# EAGLE design Charger Board_3 (Sam_Test) (EAGLE 6.5.0)
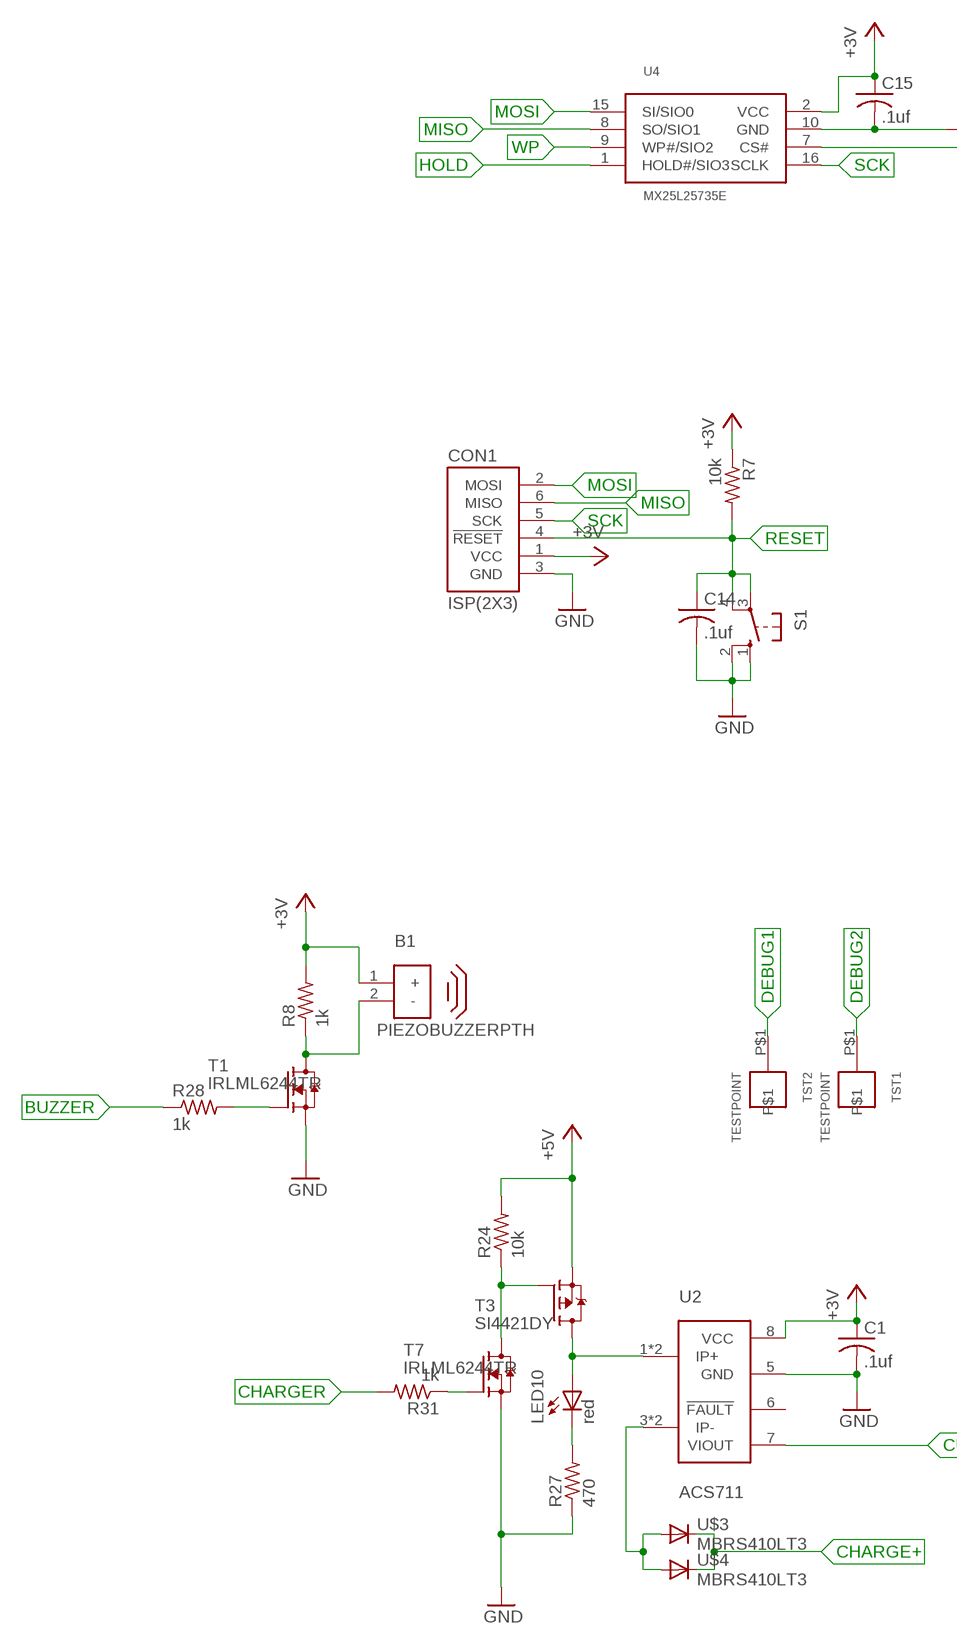
[diagram p0: schematic, sheet 1, part 1 of 2]
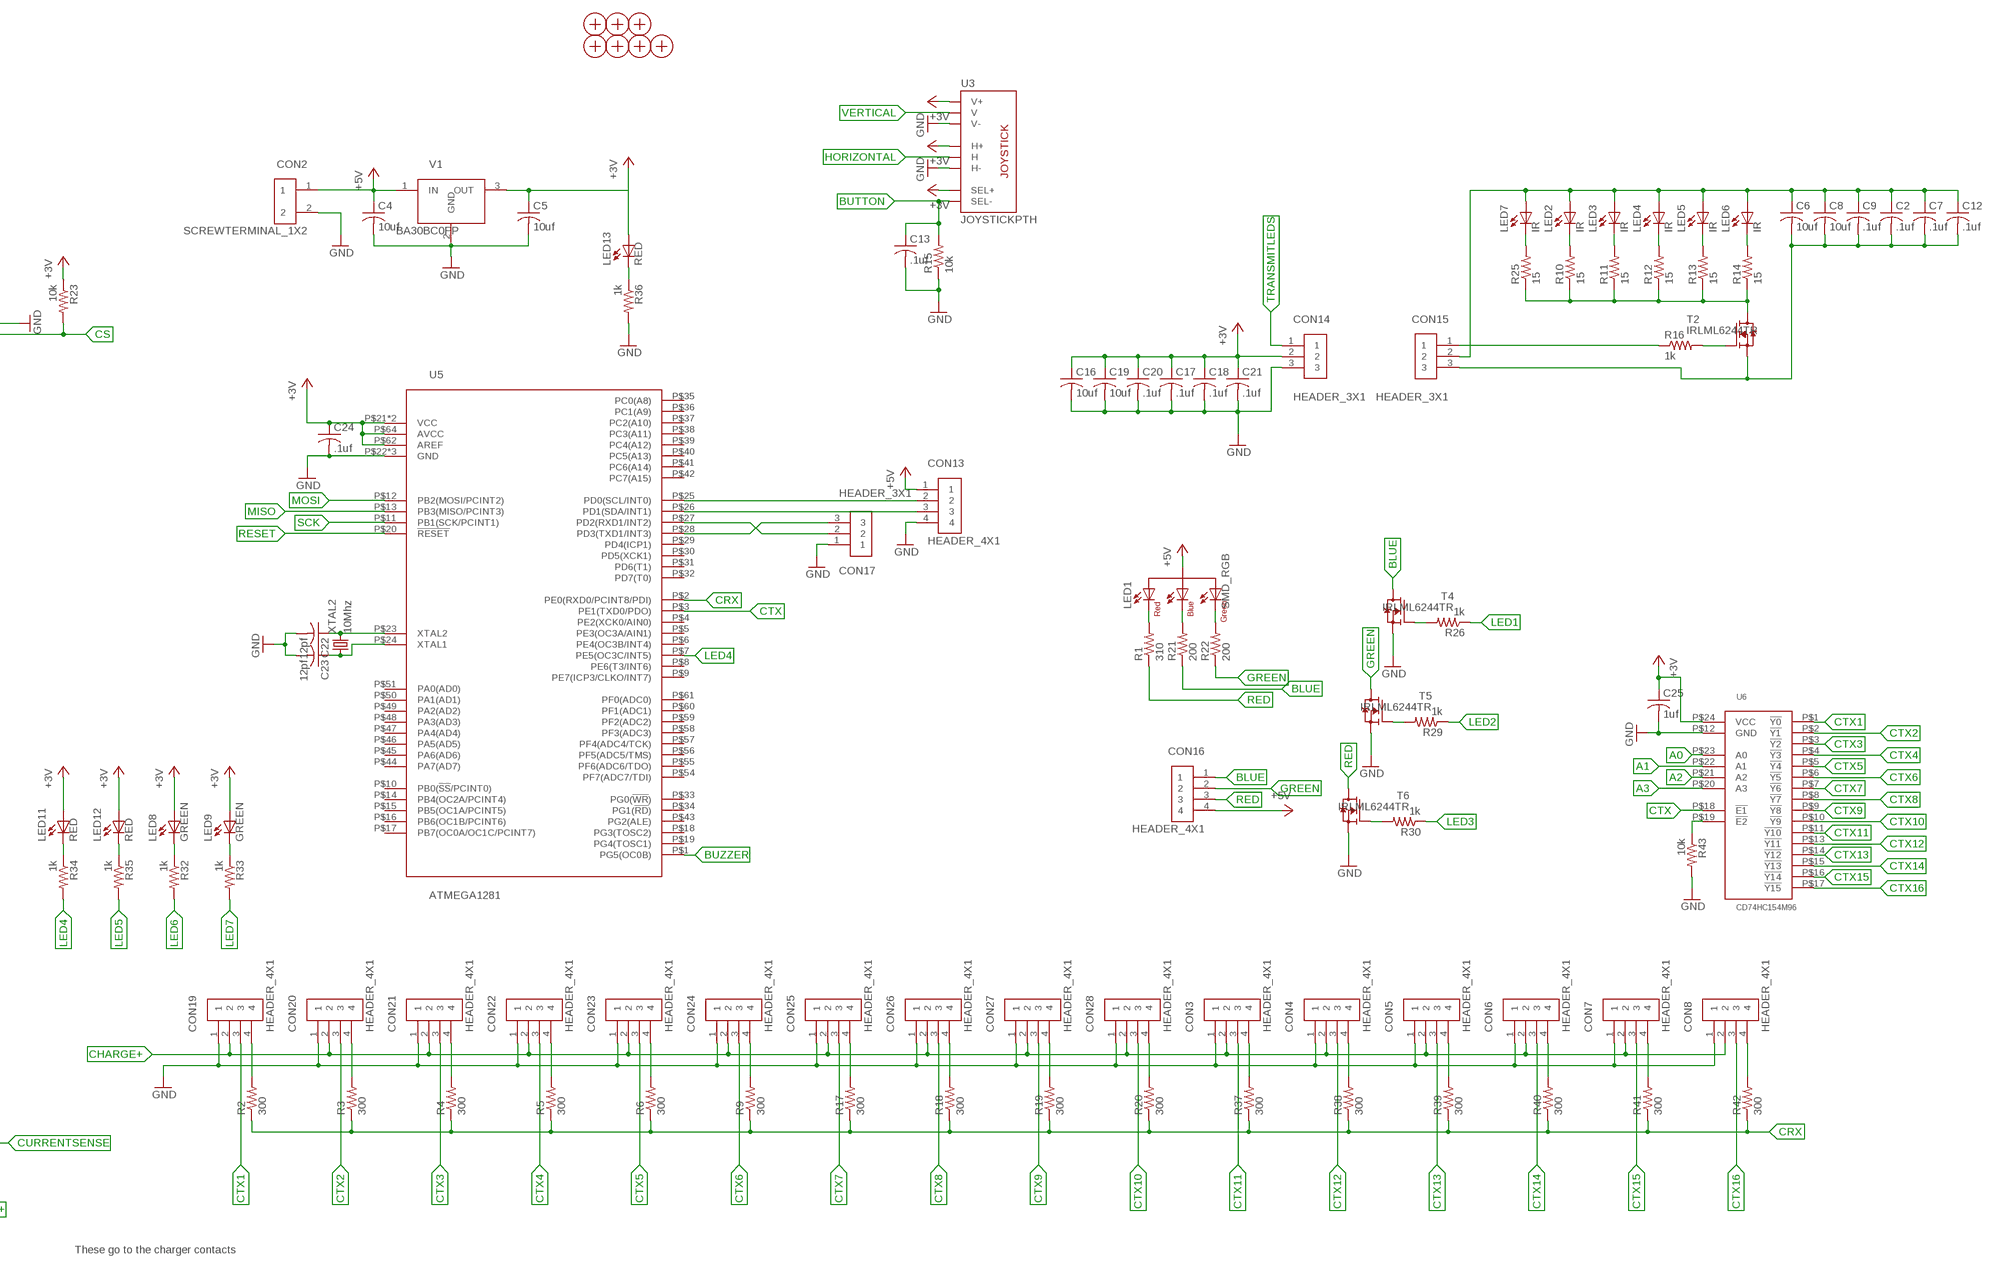
[diagram p1: schematic, sheet 1, part 2 of 2]

## Parts
B1  PIEZOBUZZERPTH  [PIEZOBUZZER]
C1  .1uf  CAP0603  [0603]
C2  .1uf  CAP0603  [0603]
C4  10uf  CAP0805  [0805]
C5  10uf  CAP0805  [0805]
C6  10uf  CAP0805  [0805]
C7  .1uf  CAP0603  [0603]
C8  10uf  CAP0805  [0805]
C9  .1uf  CAP0603  [0603]
C12  .1uf  CAP0603  [0603]
C13  .1uf  CAP0603  [0603]
C14  .1uf  CAP0603  [0603]
C15  .1uf  CAP0603  [0603]
C16  10uf  CAP0805  [0805]
C17  .1uf  CAP0603  [0603]
C18  .1uf  CAP0603  [0603]
C19  10uf  CAP0805  [0805]
C20  .1uf  CAP0603  [0603]
C21  .1uf  CAP0603  [0603]
C22  12pf  CAP0603  [0603]
C23  12pf  CAP0603  [0603]
C24  .1uf  CAP0603  [0603]
C25  1uf  CAP0603  [0603]
CON1  ISP(2X3)  [PINHEADER(2X3)]
CON2  SCREWTERMINAL_1X2  [SCREWTERMINAL_1X2]
CON3  HEADER_4X1  [4PINHEADER_.100"]
CON4  HEADER_4X1  [4PINHEADER_.100"]
CON5  HEADER_4X1  [4PINHEADER_.100"]
CON6  HEADER_4X1  [4PINHEADER_.100"]
CON7  HEADER_4X1  [4PINHEADER_.100"]
CON8  HEADER_4X1  [4PINHEADER_.100"]
CON13  HEADER_4X1  [4PINHEADER_.100"]
CON14  HEADER_3X1  [3PINHEADER_.100"]
CON15  HEADER_3X1  [3PINHEADER_.100"]
CON16  HEADER_4X1  [4PINHEADER_.100"]
CON17  HEADER_3X1  [3PINHEADER_.100"]
CON19  HEADER_4X1  [4PINHEADER_.100"]
CON20  HEADER_4X1  [4PINHEADER_.100"]
CON21  HEADER_4X1  [4PINHEADER_.100"]
CON22  HEADER_4X1  [4PINHEADER_.100"]
CON23  HEADER_4X1  [4PINHEADER_.100"]
CON24  HEADER_4X1  [4PINHEADER_.100"]
CON25  HEADER_4X1  [4PINHEADER_.100"]
CON26  HEADER_4X1  [4PINHEADER_.100"]
CON27  HEADER_4X1  [4PINHEADER_.100"]
CON28  HEADER_4X1  [4PINHEADER_.100"]
H1  MOUNTINGHOLE  [MOUNTINGHOLE]
H2  MOUNTINGHOLE  [MOUNTINGHOLE]
H3  MOUNTINGHOLE  [MOUNTINGHOLE]
H4  MOUNTINGHOLE  [MOUNTINGHOLE]
H5  MOUNTINGHOLE  [MOUNTINGHOLE]
H6  MOUNTINGHOLE  [MOUNTINGHOLE]
H7  MOUNTINGHOLE  [MOUNTINGHOLE]
LED1  SMD_RGB  [PLCC4]
LED2  IR  LED5MMRA  [5MM_LED_RA]
LED3  IR  LED5MMRA  [5MM_LED_RA]
LED4  IR  LED5MMRA  [5MM_LED_RA]
LED5  IR  LED5MMRA  [5MM_LED_RA]
LED6  IR  LED5MMRA  [5MM_LED_RA]
LED7  IR  LED5MMRA  [5MM_LED_RA]
LED8  GREEN  LED0603  [LED0603]
LED9  GREEN  LED0603  [LED0603]
LED10  red  LED0603  [LED0603]
LED11  RED  LED0603  [LED0603]
LED12  RED  LED0603  [LED0603]
LED13  RED  LED0603  [LED0603]
R1  310  RES0603  [0603]
R2  300  RES0603  [0603]
R3  300  RES0603  [0603]
R4  300  RES0603  [0603]
R5  300  RES0603  [0603]
R6  300  RES0603  [0603]
R7  10k  RES0603  [0603]
R8  1k  RES0603  [0603]
R9  300  RES0603  [0603]
R10  15  RES0603  [0603]
R11  15  RES0603  [0603]
R12  15  RES0603  [0603]
R13  15  RES0603  [0603]
R14  15  RES0603  [0603]
R15  10k  RES0603  [0603]
R16  1k  RES0603  [0603]
R17  300  RES0603  [0603]
R18  300  RES0603  [0603]
R19  300  RES0603  [0603]
R20  300  RES0603  [0603]
R21  200  RES0603  [0603]
R22  200  RES0603  [0603]
R23  10k  RES0603  [0603]
R24  10k  RES0603  [0603]
R25  15  RES0603  [0603]
R26  1k  RES0603  [0603]
R27  470  RES0603  [0603]
R28  1k  RES0603  [0603]
R29  1k  RES0603  [0603]
R30  1k  RES0603  [0603]
R31  1k  RES0603  [0603]
R32  1k  RES0603  [0603]
R33  1k  RES0603  [0603]
R34  1k  RES0603  [0603]
R35  1k  RES0603  [0603]
R36  1k  RES0603  [0603]
R37  300  RES0603  [0603]
R38  300  RES0603  [0603]
R39  300  RES0603  [0603]
R40  300  RES0603  [0603]
R41  300  RES0603  [0603]
R42  300  RES0603  [0603]
R43  10k  RES0603  [0603]
S1  10-XX  [B3F-10XX]
T1  IRLML6244TR  [SOT23]
T2  IRLML6244TR  [SOT23]
T3  SI4421DY  [S0-8]
T4  IRLML6244TR  [SOT23]
T5  IRLML6244TR  [SOT23]
T6  IRLML6244TR  [SOT23]
T7  IRLML6244TR  [SOT23]
TST1  TESTPOINT  [TESTPOINT]
TST2  TESTPOINT  [TESTPOINT]
U2  ACS711  [8SOIC]
U3  JOYSTICKPTH  [JOYSTICK]
U4  MX25L25735E  [SOIC16R]
U5  ATMEGA1281  [TQFP64]
U6  CD74HC154M96  [24SOIC]
U$3  MBRS410LT3  [SMD_DIODE]
U$4  MBRS410LT3  [SMD_DIODE]
V1  BA30BC0FP  [DPAK]
XTAL2  10Mhz  NX5032GA-10.000000MHZ  [SMDXTAL]

## Nets
+3V: B1.1(+) C1.1 C5.1 C15.1 C16.1 C17.1 C18.1 C19.1 C20.1 C21.1 C24.1 C25.1 CON1.1(VCC) CON14.2 LED8.2(A) LED9.2(A) LED11.2(A) LED12.2(A) LED13.2(A) R7.1 R8.2 R23.1 U2.8(VCC) U3.B1A(SEL+) U3.H1(H+) U3.V1(V+) U4.2(VCC) U5.P$21(VCC) U5.P$52(VCC) U5.P$62(AREF) U5.P$64(AVCC) U6.P$24(VCC) V1.3(OUT)
+5V: C4.1 CON2.1 CON13.1 CON16.4 LED1.2(COMMONANODE) R24.2 T3.1(S) T3.2(S) T3.3(S) V1.1(IN)
A0: U6.P$23(A0)
A1: U6.P$22(A1)
A2: U6.P$21(A2)
A3: U6.P$20(A3)
BLUE: CON16.1 R21.1 T4.3(D)
BUTTON: C13.1 R15.2 U3.B2A(SEL-)
BUZZER: R28.1 U5.P$1(PG5(OC0B))
CHARGE+: CON3.2 CON4.2 CON5.2 CON6.2 CON7.2 CON8.2 CON19.2 CON20.2 CON21.2 CON22.2 CON23.2 CON24.2 CON25.2 CON26.2 CON27.2 CON28.2 U$3.2(C) U$4.2(C)
CHARGER: R31.2
CRX: R2.1 R3.1 R4.1 R5.1 R6.1 R9.1 R17.1 R18.1 R19.1 R20.1 R37.1 R38.1 R39.1 R40.1 R41.1 R42.1 U5.P$2(PE0(RXD0/PCINT8/PDI))
CS: R23.2 U4.7(CS#)
CTX: U5.P$3(PE1(TXD0/PDO)) U6.P$18(!E1)
CTX1: CON19.3 U6.P$1(!Y0)
CTX2: CON20.3 U6.P$2(!Y1)
CTX3: CON21.3 U6.P$3(!Y2)
CTX4: CON22.3 U6.P$4(!Y3)
CTX5: CON23.3 U6.P$5(!Y4)
CTX6: CON24.3 U6.P$6(!Y5)
CTX7: CON25.3 U6.P$7(!Y6)
CTX8: CON26.3 U6.P$8(!Y7)
CTX9: CON27.3 U6.P$9(!Y8)
CTX10: CON28.3 U6.P$10(!Y9)
CTX11: CON3.3 U6.P$11(!Y10)
CTX12: CON4.3 U6.P$13(!Y11)
CTX13: CON5.3 U6.P$14(!Y12)
CTX14: CON6.3 U6.P$15(!Y13)
CTX15: CON7.3 U6.P$16(!Y14)
CTX16: CON8.3 U6.P$17(!Y15)
CURRENTSENSE: U2.7(VIOUT)
DEBUG1: TST2.P$1
DEBUG2: TST1.P$1
GND: C1.2 C4.2 C5.2 C13.2 C14.2 C15.2 C16.2 C17.2 C18.2 C19.2 C20.2 C21.2 C22.2 C23.2 C24.2 C25.2 CON1.3(GND) CON2.2 CON3.1 CON4.1 CON5.1 CON6.1 CON7.1 CON8.1 CON13.4 CON14.3 CON17.1 CON19.1 CON20.1 CON21.1 CON22.1 CON23.1 CON24.1 CON25.1 CON26.1 CON27.1 CON28.1 R15.1 R27.1 R36.2 R43.2 S1.1(S) S1.2(S1) T1.2(S) T4.2(S) T5.2(S) T6.2(S) T7.2(S) U2.5(GND) U3.H3(H-) U3.V3(V-) U4.10(GND) U5.P$22(GND) U5.P$53(GND) U5.P$63(GND) U6.P$12(GND) V1.2(GND)
GREEN: CON16.2 R22.1 T5.3(D)
HOLD: U4.1(HOLD#/SIO3)
HORIZONTAL: U3.H2(H)
LED1: R26.1
LED2: R29.1
LED3: R30.1
LED4: R34.2 U5.P$7(PE5(OC3C/INT5))
LED5: R35.2
LED6: R32.2
LED7: R33.2
MISO: CON1.6(MISO) U4.8(SO/SIO1) U5.P$13(PB3(MISO/PCINT3))
MOSI: CON1.2(MOSI) U4.15(SI/SIO0) U5.P$12(PB2(MOSI/PCINT2))
N$1: LED10.2(A) T3.5(D) T3.6(D) T3.7(D) T3.8(D) U2.1(IP+) U2.2(IP+)
N$2: CON15.1 R16.1
N$3: C2.1 C6.1 C7.1 C8.1 C9.1 C12.1 CON15.2 LED2.1(A) LED3.1(A) LED4.1(A) LED5.1(A) LED6.1(A) LED7.1(A)
N$5: C2.2 C6.2 C7.2 C8.2 C9.2 C12.2 CON15.3 T2.2(S)
N$6: LED7.2(C) R25.2
N$9: B1.2(-) R8.1 T1.3(D)
N$10: R10.1 R11.1 R12.1 R13.1 R14.1 R25.1 T2.3(D)
N$11: R16.2 T2.1(G)
N$13: LED2.2(C) R10.2
N$14: LED3.2(C) R11.2
N$15: LED4.2(C) R12.2
N$16: LED5.2(C) R13.2
N$17: LED6.2(C) R14.2
N$20: R24.1 T3.4(G) T7.3(D)
N$21: R31.1 T7.1(G)
N$22: LED10.1(C) R27.2
N$23: U2.3(IP-) U2.4(IP-) U$3.1(A) U$4.1(A)
N$24: CON20.4 R3.2
N$26: R28.2 T1.1(G)
N$27: CON19.4 R2.2
N$28: CON21.4 R4.2
N$29: CON22.4 R5.2
N$30: CON23.4 R6.2
N$31: CON24.4 R9.2
N$32: CON25.4 R17.2
N$33: CON26.4 R18.2
N$34: CON27.4 R19.2
N$35: CON28.4 R20.2
N$36: R26.2 T4.1(G)
N$37: LED1.1(REDCATHODE) R1.2
N$38: LED1.3(BLUECATHODE) R21.2
N$39: LED1.4(GREENCATHODE) R22.2
N$40: R29.2 T5.1(G)
N$41: R30.2 T6.1(G)
N$42: LED8.1(C) R32.1
N$43: LED9.1(C) R33.1
N$44: LED11.1(C) R34.1
N$45: LED12.1(C) R35.1
N$46: LED13.1(C) R36.1
N$47: C22.1 U5.P$23(XTAL2) XTAL2.2
N$48: C23.1 U5.P$24(XTAL1) XTAL2.1
N$49: CON3.4 R37.2
N$50: CON4.4 R38.2
N$51: CON5.4 R39.2
N$52: CON6.4 R40.2
N$53: CON7.4 R41.2
N$54: CON8.4 R42.2
N$55: CON13.2 U5.P$25(PD0(SCL/INT0))
N$56: CON13.3 U5.P$26(PD1(SDA/INT1))
N$57: R43.1 U6.P$19(!E2)
N$60: CON17.2 U5.P$27(PD2(RXD1/INT2))
N$61: CON17.3 U5.P$28(PD3(TXD1/INT3))
RED: CON16.3 R1.1 T6.3(D)
RESET: C14.1 CON1.4(!RESET) R7.2 S1.3(P) S1.4(P1) U5.P$20(!RESET!)
SCK: CON1.5(SCK) U4.16(SCLK) U5.P$11(PB1(SCK/PCINT1))
TRANSMITLEDS: CON14.1
VERTICAL: U3.V2(V)
WP: U4.9(WP#/SIO2)
Unconnected: U2.6(!FAULT) U5.P$4(PE2(XCK0/AIN0)) U5.P$5(PE3(OC3A/AIN1)) U5.P$6(PE4(OC3B/INT4)) U5.P$8(PE6(T3/INT6)) U5.P$9(PE7(ICP3/CLKO/INT7)) U5.P$10(PB0(!SS!/PCINT0)) U5.P$14(PB4(OC2A/PCINT4)) U5.P$15(PB5(OC1A/PCINT5)) U5.P$16(PB6(OC1B/PCINT6)) U5.P$17(PB7(OC0A/OC1C/PCINT7)) U5.P$18(PG3(TOSC2)) U5.P$19(PG4(TOSC1)) U5.P$29(PD4(ICP1)) U5.P$30(PD5(XCK1)) U5.P$31(PD6(T1)) U5.P$32(PD7(T0)) U5.P$33(PG0(!WR!)) U5.P$34(PG1(!RD!)) U5.P$35(PC0(A8)) U5.P$36(PC1(A9)) U5.P$37(PC2(A10)) U5.P$38(PC3(A11)) U5.P$39(PC4(A12)) U5.P$40(PC5(A13)) U5.P$41(PC6(A14)) U5.P$42(PC7(A15)) U5.P$43(PG2(ALE)) U5.P$44(PA7(AD7)) U5.P$45(PA6(AD6)) U5.P$46(PA5(AD5)) U5.P$47(PA4(AD4)) U5.P$48(PA3(AD3)) U5.P$49(PA2(AD2)) U5.P$50(PA1(AD1)) U5.P$51(PA0(AD0)) U5.P$54(PF7(ADC7/TDI)) U5.P$55(PF6(ADC6/TDO)) U5.P$56(PF5(ADC5/TMS)) U5.P$57(PF4(ADC4/TCK)) U5.P$58(PF3(ADC3)) U5.P$59(PF2(ADC2)) U5.P$60(PF1(ADC1)) U5.P$61(PF0(ADC0))

## Notes on the sheet
- These go to the charger contacts

## Library data of the parts
B1 = Passive:PIEZOBUZZER: Digikey Part Number: 445-2525-1-ND Manufacturer Part Number: PS1240P02BT
C1 C2 C4-C9 C12-C25 = Passive:CAP
CON1 = Mechanical:ISP
CON2 = Mechanical:SCREWTERMINAL_1X2: Digikey Part Number: ED1631-ND Manufacturer Part Number: ED700/2
CON3-CON8 CON13 CON16 CON19-CON28 = Mechanical:HEADER_4X1
CON14 CON15 CON17 = Mechanical:HEADER_3X1
H1-H7 = Mechanical:MOUNTINGHOLE
LED1 = Passive:SMD_RGB: Digikey Part Number: CLVBA-FKA-CAEDH8BBB7A363CT-ND Manufacturer Part Number: CLVBA-FKA-CAEDH8BBB7A363
LED2-LED13 = Passive:LED
R1-R43 = Passive:RES
S1 = switch-omron:10-XX: OMRON SWITCH; MPN: B3F-1000; OC_FARNELL: 176432; OC_NEWARK: 36M3542
T1 T2 T4-T7 = Passive:IRLML6244TR: Digikey Part Number: IRLML6244TRPBFCT-ND Manufacturer Part Number: IRLML6244TRPBF
T3 = Passive:SI4421DY: Digikey Part Number: SI4421DY-T1-E3CT-ND Manufacturer Part Number: SI4421DY-T1-E3
TST1 TST2 = Mechanical:TESTPOINT
U2 = PowerIC:ACS711
U3 = SparkFun:JOYSTICK: Thumb Joystick Joystick commonly found in PS2 controllers. Two pots and a select switch. Footprint proven. Spark Fun Electronics SKU : COM-09032
U4 = DigitalIC:MX25L25735E: Digikey Part Number: 1092-1000-ND Manufacturer Part Number: MX25L25735EMI-12G
U5 = DigitalIC:ATMEGA1281: Digikey Part Number: ATMEGA1281V-8AU-ND Manufacturer Part Number: ATMEGA1281V-8AU
U6 = DigitalIC:CD74HC154M96: Digikey Part Number: 296-24352-1-ND Manufacturer Part Number: CD74HC154M96
U$3 U$4 = Passive:MBRS410LT3: Digikey Part Number: MBRS410LT3GOSCT-ND Manufacturer Part Number: MBRS410LT3G
V1 = PowerIC:BA30BC0FP: Digikey Part Number: BA30BC0FP-E2CT-ND Manufacturer Cart Number: BA30BC0FP-E2
XTAL2 = Passive:NX5032GA-10.000000MHZ: Digikey Part Number: 644-1033-1-ND Manufacturer Part Number: NX5032GA-10.000000MHZ-LN-CD-1

## Board
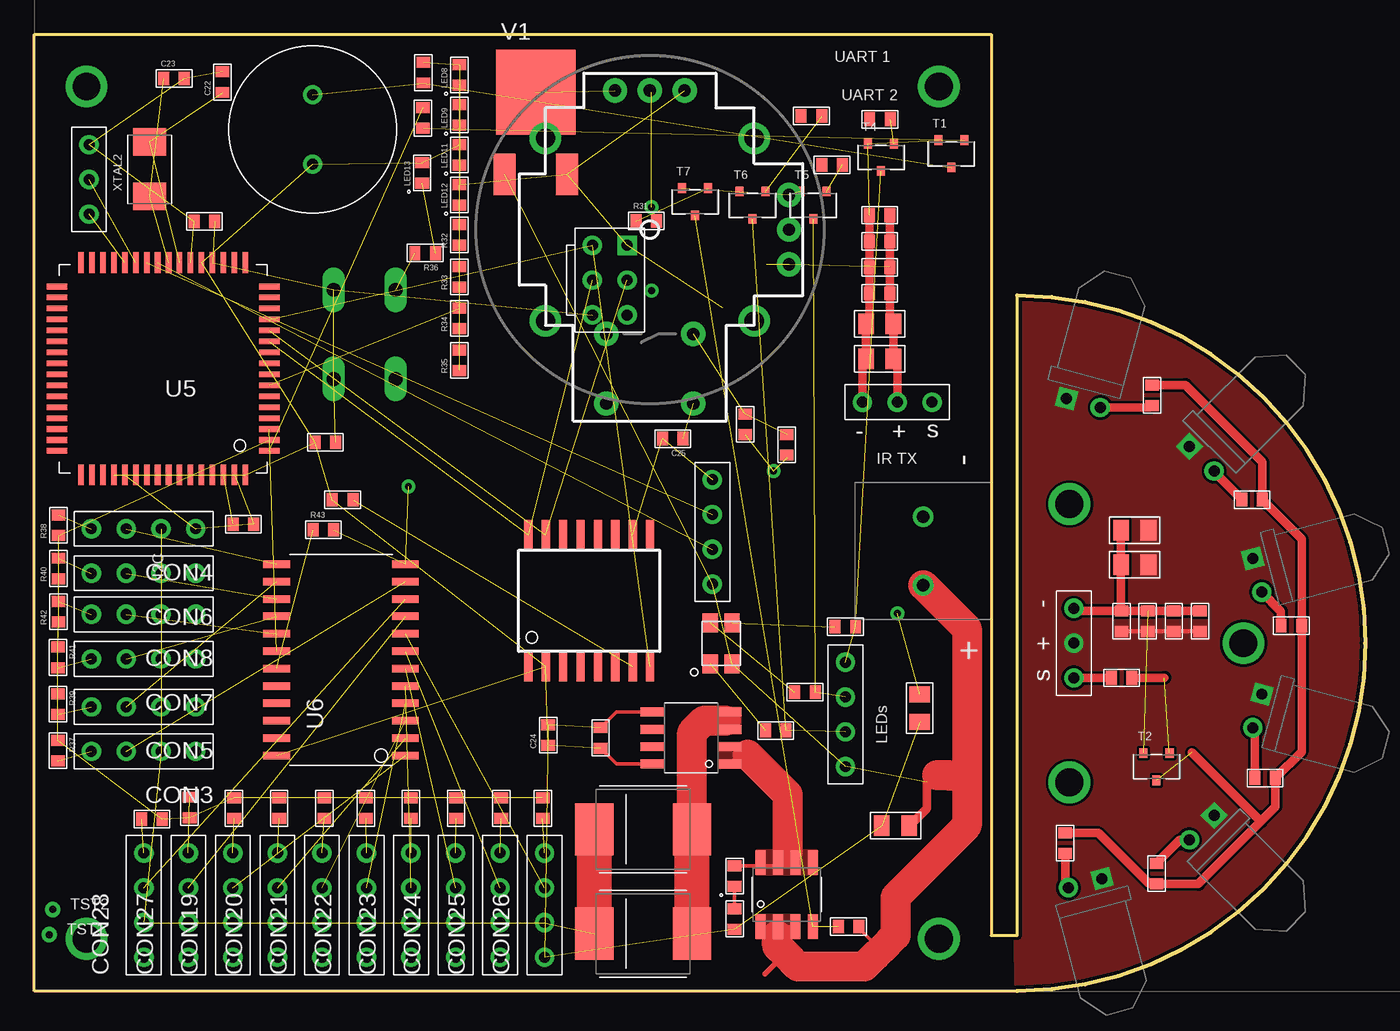
[diagram p2: board, top side]
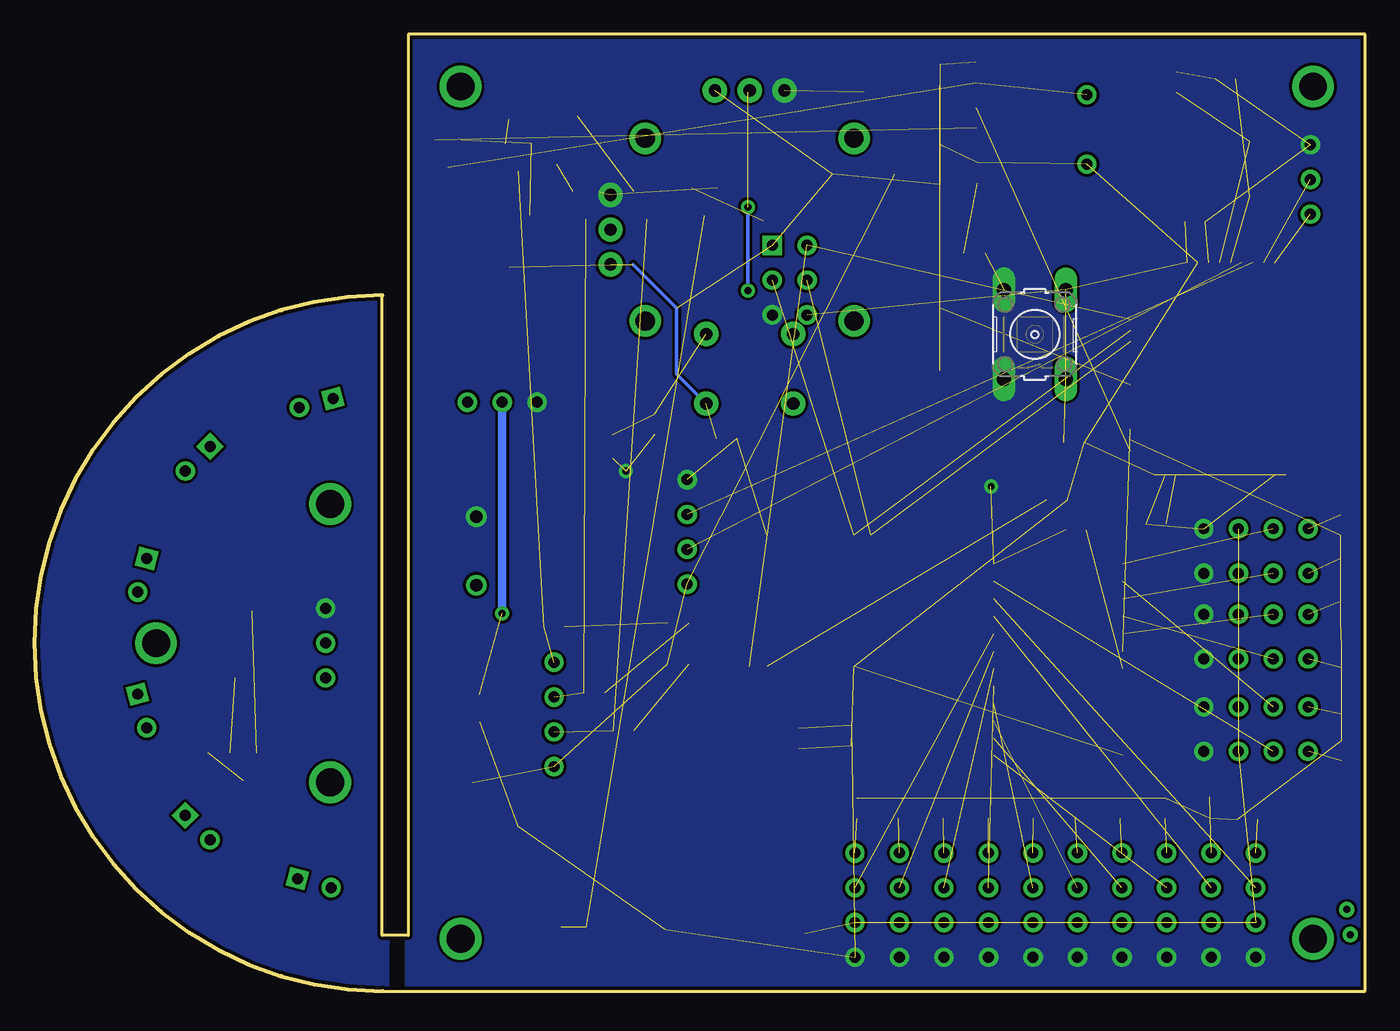
[diagram p3: board, bottom side, seen from below]

Size 97.16 x 69.85 mm. Coordinates in mm from the lower left corner, seen from the top.
Outline: 71.75,50.8 arc-180 71.75,0 0,0 0,69.85 69.85,69.85 69.85,4.06 71.75,4.06 71.75,50.8
Copper layers (1*16): Top 0.035mm / dielectric 1.5mm / Bottom 0.035mm
Design rules "default": minimum track width 8mil, minimum drill 20mil, track to track 8mil, track to pad 8mil, pad to pad 8mil, via to via 8mil, smd to smd 8mil, copper to edge 10mil, drill to drill 8mil, minimum pad ring 12mil, minimum via ring 10mil, stop-mask expansion 4mil, vias tented up to drill 25mil, thermal gap 10mil

### Footprints (pad centres in the part's own frame; a part is rotated, then mirrored left to right if it is on the bottom)
PIEZOBUZZER = drill 0.8: 1 -2.54,0; 2 2.54,0
0603 = smd 0.8 x 1: 1 -0.75,0; 2 0.75,0
0805 = smd 1.15 x 1.5: 1 -1,0; 2 1,0
PINHEADER(2X3) = drill 0.8 square: 1 -2.54,1.27 | drill 0.8: 2 0,1.27; 3 2.54,1.27; 4 2.54,-1.27; 5 0,-1.27; 6 -2.54,-1.27
SCREWTERMINAL_1X2 = drill 0.9: 1 -2.5,0; 2 2.5,0
4PINHEADER_.100" = drill 0.8: 1 -2.54,0; 2 0,0; 3 2.54,0; 4 5.08,0
3PINHEADER_.100" = drill 0.8: 1 -2.54,0; 2 0,0; 3 2.54,0
MOUNTINGHOLE = drill 2.032 pad 2.286: P$2 0,0
PLCC4 = smd 1.4 x 1.1: 1 -1.5,0.8; 2 -1.5,-0.8; 3 1.5,-0.8; 4 1.5,0.8
5MM_LED_RA = drill 0.8 square: 1 -1.27,0 | drill 0.8: 2 1.27,0
LED0603 = smd 0.8 x 1: 1 -0.75,0; 2 0.75,0
B3F-10XX = drill 1.016 long: 1 -3.251,2.261; 2 3.251,2.261; 3 -3.251,-2.261; 4 3.251,-2.261
SOT23 = smd 0.6 x 0.7: 1 0.95,1; 2 -0.95,1; 3 0,-1
S0-8 = smd 0.72 x 1.78: 1 -1.905,-2.34; 2 -0.635,-2.34; 3 0.635,-2.34; 4 1.905,-2.34; 5 1.905,2.34; 6 0.635,2.34; 7 -0.635,2.34; 8 -1.905,2.34
TESTPOINT = drill 0.508: P$1 0,0
8SOIC = smd 0.65 x 1.75: 1 -1.905,-2.8; 2 -0.635,-2.8; 3 0.635,-2.8; 4 1.905,-2.8; 5 1.905,2.8; 6 0.635,2.8; 7 -0.635,2.8; 8 -1.905,2.8
JOYSTICK = drill 0.9 pad 1.778: B1A -3.175,12.7; B1B 3.175,12.7; B2A -3.175,7.62; B2B 3.175,7.62 | drill 0.889 pad 1.778: H1 -2.54,-10.16; H2 0,-10.16; H3 2.54,-10.16; V1 -10.16,2.54; V2 -10.16,0; V3 -10.16,-2.54 | drill 1.397 pad 2.286: MOUNT1 -7.62,6.668; MOUNT2 -7.62,-6.668; MOUNT3 7.62,-6.668; MOUNT4 7.62,6.668
SOIC16R = smd 0.6 x 2.2: 1 -4.445,-4.775; 2 -3.175,-4.775; 3 -1.905,-4.775; 4 -0.635,-4.775; 5 0.635,-4.775; 6 1.905,-4.775; 7 3.175,-4.775; 8 4.445,-4.775; 9 4.445,4.8; 10 3.175,4.8; 11 1.905,4.8; 12 0.635,4.8; 13 -0.635,4.8; 14 -1.905,4.8; 15 -3.175,4.8; 16 -4.445,4.8
TQFP64 = smd 1.5 x 0.406: P$1 -7.75,6; P$2 -7.75,5.2; P$3 -7.75,4.4; P$4 -7.75,3.6; P$5 -7.75,2.8; P$6 -7.75,2; P$7 -7.75,1.2; P$8 -7.75,0.4; P$9 -7.75,-0.4; P$10 -7.75,-1.2; P$11 -7.75,-2; P$12 -7.75,-2.8; P$13 -7.75,-3.6; P$14 -7.75,-4.4; P$15 -7.75,-5.2; P$16 -7.75,-6; P$33 7.75,-6; P$34 7.75,-5.2; P$35 7.75,-4.4; P$36 7.75,-3.6; P$37 7.75,-2.8; P$38 7.75,-2; P$39 7.75,-1.2; P$40 7.75,-0.4; P$41 7.75,0.4; P$42 7.75,1.2; P$43 7.75,2; P$44 7.75,2.8; P$45 7.75,3.6; P$46 7.75,4.4; P$47 7.75,5.2; P$48 7.75,6 | smd 0.406 x 1.5: P$17 -6,-7.75; P$18 -5.2,-7.75; P$19 -4.4,-7.75; P$20 -3.6,-7.75; P$21 -2.8,-7.75; P$22 -2,-7.75; P$23 -1.2,-7.75; P$24 -0.4,-7.75; P$25 0.4,-7.75; P$26 1.2,-7.75; P$27 2,-7.75; P$28 2.8,-7.75; P$29 3.6,-7.75; P$30 4.4,-7.75; P$31 5.2,-7.75; P$32 6,-7.75; P$49 6,7.75; P$50 5.2,7.75; P$51 4.4,7.75; P$52 3.6,7.75; P$53 2.8,7.75; P$54 2,7.75; P$55 1.2,7.75; P$56 0.4,7.75; P$57 -0.4,7.75; P$58 -1.2,7.75; P$59 -2,7.75; P$60 -2.8,7.75; P$61 -3.6,7.75; P$62 -4.4,7.75; P$63 -5.2,7.75; P$64 -6,7.75
24SOIC = smd 0.55 x 1.95: P$1 -6.985,-4.7; P$2 -5.715,-4.7; P$3 -4.445,-4.7; P$4 -3.175,-4.7; P$5 -1.905,-4.7; P$6 -0.635,-4.7; P$7 0.635,-4.7; P$8 1.905,-4.7; P$9 3.175,-4.7; P$10 4.445,-4.7; P$11 5.715,-4.7; P$12 6.985,-4.7; P$13 6.985,4.7; P$14 5.715,4.7; P$15 4.445,4.7; P$16 3.175,4.7; P$17 1.905,4.7; P$18 0.635,4.7; P$19 -0.635,4.7; P$20 -1.905,4.7; P$21 -3.175,4.7; P$22 -4.445,4.7; P$23 -5.715,4.7; P$24 -6.985,4.7
SMD_DIODE = smd 2.794 x 3.81: 1 -3.568,0; 2 3.568,0
DPAK = smd 1.6 x 3: 1 -2.28,-5.99; 3 2.28,-5.99 | smd 5.8 x 6.2: 2 0,0
SMDXTAL = smd 2 x 2.4: 1 -2,0; 2 2,0

### Placement (x,y rotation side)
B1  20.32,62.9 90 top
C1  41.34,18.48 90 top
C2  83.19,26.99 90 top
C4  62.87,12.06 180 top
C5  64.64,20.66 270 top
C6  80.33,31.11 180 top
C7  85.09,26.99 90 top
C8  80.33,33.66 180 top
C9  79.38,26.99 90 top
C12  81.28,26.99 90 top
C13  51.9,41.38 270 top
C14  12.44,56.18 180 top
C15  15.27,34.08 0 top
C16  61.72,46.16 180 top
C17  61.72,52.83 180 top
C18  61.72,50.93 180 top
C19  61.72,48.7 180 top
C20  61.72,56.64 180 top
C21  61.72,54.74 180 top
C22  13.74,66.35 90 top
C23  10.21,66.62 0 top
C24  37.51,18.68 90 top
C25  46.59,40.33 180 top
CON1  42.01,51.9 270 top
CON2  64.9,32.13 90 top
CON3  9.25,17.5 180 top
CON4  9.25,33.75 180 top
CON5  9.25,20.75 180 top
CON6  9.25,30.5 180 top
CON7  9.25,24.25 180 top
CON8  9.25,27.5 180 top
CON13  49.5,32.25 90 top
CON14  62.99,42.99 180 top
CON15  75.88,25.4 90 top
CON16  59.21,21.46 270 top
CON17  4,59.25 270 top
CON19  14.5,5 90 top
CON20  17.75,5 90 top
CON21  21,5 90 top
CON22  24.25,5 90 top
CON23  27.5,5 90 top
CON24  30.75,5 90 top
CON25  34,5 90 top
CON26  37.25,5 90 top
CON27  11.25,5 90 top
CON28  8,5 90 top
H1  3.81,3.81 0 top
H2  3.81,66.04 0 top
H3  66.04,66.04 0 top
H4  66.04,3.81 0 top
H5  75.56,35.56 0 top
H6  75.56,15.24 0 top
H7  88.27,25.4 0 top
LED1  50.14,25.38 90 top
LED2  89.28,20.45 255 top
LED3  76.71,7.87 195 top
LED4  85.22,38.87 315 top
LED5  76.58,42.93 345 top
LED6  89.28,30.35 285 top
LED7  85.22,11.93 225 top
LED8  31.03,66.88 90 top
LED9  31.03,63.96 90 top
LED10  51.12,8.38 90 top
LED11  31.03,61.04 90 top
LED12  31.03,58.12 90 top
LED13  28.31,59.73 90 top
R1  54.12,19.02 180 top
R2  14.59,13.34 270 top
R3  17.88,13.34 270 top
R4  21.17,13.34 270 top
R5  24.21,13.34 270 top
R6  27.5,13.34 270 top
R7  21.24,40.06 0 top
R8  28.4,67.04 90 top
R9  30.79,13.34 270 top
R10  89.85,15.56 180 top
R11  75.25,10.79 270 top
R12  88.9,35.88 180 top
R13  81.6,43.5 270 top
R14  91.76,26.67 180 top
R15  54.93,39.88 90 top
R16  79.38,22.86 0 top
R17  34.08,13.34 270 top
R18  37.12,13.34 270 top
R19  11.34,13.41 90 top
R20  8.59,12.55 180 top
R21  59.21,26.59 180 top
R22  56.26,21.81 180 top
R23  22.51,35.86 0 top
R24  59.44,4.7 0 top
R25  81.92,8.57 90 top
R26  61.73,63.64 0 top
R27  51.12,5.27 90 top
R28  28.37,63.73 270 top
R29  58.23,60.32 0 top
R30  56.73,63.88 0 top
R31  44.68,56.22 0 top
R32  31.03,55.2 90 top
R33  31.03,52.15 90 top
R34  31.03,49.1 90 top
R35  31.03,46.05 90 top
R36  28.53,53.88 180 top
R37  1.73,17.55 270 top
R38  1.77,34 90 top
R39  1.73,20.95 270 top
R40  1.77,30.85 90 top
R41  1.73,24.36 270 top
R42  1.77,27.69 90 top
R43  21.11,33.67 0 top
S1  24.12,47.94 90 bottom
T1  66.94,61.11 0 top
T2  81.92,16.38 0 top
T3  54.93,7.05 0 top
T4  61.81,60.86 0 top
T5  56.87,57.36 0 top
T6  52.43,57.36 0 top
T7  48.24,57.61 0 top
TST1  1.1,4.12 0 top
TST2  1.35,5.95 0 top
U2  47.94,18.48 90 top
U3  44.93,55.59 180 top
U4  40.51,28.48 0 top
U5  9.41,45.43 180 top
U6  22.39,24.18 90 top
U$3  44.45,4.19 180 top
U$4  44.45,11.81 180 top
V1  36.6,65.61 0 top
XTAL2  8.41,60 90 top

### Tracks (layer width: path | path; a pad name or v marks a point on that pad's centre or on a via)
+3V  (via drill 0.51)  (25 unrouted)
  Top 0.254: U2.8 42.49,16.57 C1.1
  Top 0.305: C19.1 62.47,48.95
  Top 0.61: C19.1 C16.1 62.99,45.9 CON14.2 | 62.47,48.95 C18.1 C17.1 C21.1 C20.1
  Bottom 0.254: 53.44,53.05 50.27,49.87 50.27,45.05 U3.B1A
  Bottom 0.61: CON14.2 v62.99,27.56
+5V  (4 unrouted)
  Top 0.203: 65.91,15.75 65.53,15.37 65.14,15.24
  Top 0.254: T3.3 54.35,4.71 54.29,4.76 | T3.2 53.98,4.39 53.98,4.19 | 61.4,3.48 61.4,2.6 | 54.74,2.67 54.86,2.67 | R24.2 60.19,4.58 61.78,2.98
  Top 0.406: 53.34,1.27 54.74,2.67
  Top 0.61: 65.14,15.24 65.14,13.35 C4.1
  Top 2.184: 68.07,15.75 66.78,15.73 66.76,15.75 65.91,15.75 | 54.23,4.06 54.23,3.3 54.86,2.67 55.75,1.78 60.58,1.78 61.4,2.6 61.78,2.98 62.87,4.06 62.87,6.86 68.07,12.06 68.07,15.75 | CON2.1 68.07,26.46 68.07,15.75
  pour Top (no thermals): 55.82,3.87 55.82,5.52 52.77,5.52 52.77,3.87
BLUE  (2 unrouted)
BUTTON  (2 unrouted)
BUZZER  (1 unrouted)
CHARGE+  (16 unrouted)
  Top 2.54: U$3.2 U$4.2
CRX  (16 unrouted)
CS  (1 unrouted)
CTX  (1 unrouted)
CTX1  (1 unrouted)
CTX2  (1 unrouted)
CTX3  (1 unrouted)
CTX4  (1 unrouted)
CTX5  (1 unrouted)
CTX6  (1 unrouted)
CTX7  (1 unrouted)
CTX8  (1 unrouted)
CTX9  (1 unrouted)
CTX10  (1 unrouted)
CTX11  (1 unrouted)
CTX12  (1 unrouted)
CTX13  (1 unrouted)
CTX14  (1 unrouted)
CTX15  (1 unrouted)
CTX16  (1 unrouted)
GND  (via drill 0.51)  (25 unrouted)
  Top 0.254: U2.5 42.49,20.38 C1.2 | R15.1 54.93,38.92 | 60.45,45.9 C16.2
  Top 0.305: C19.2 60.97,48.95
  Top 0.61: C16.2 C19.2 | 60.97,48.95 C18.2 C17.2 C21.2 C20.2 | CON14.3 60.45,45.9
  other vias: 53.98,37.97 27.31,36.83
  pour Bottom (no thermals): 0,81.28 69.98,81.28 69.98,0 0,0
GREEN  (2 unrouted)
HORIZONTAL  (via drill 0.51)  (1 unrouted)
  Top 0.254: 45.06,65.62 U3.H2
  Bottom 0.254: v45.06,51.14 v45.06,57.24
LED4  (1 unrouted)
MISO  (2 unrouted)
MOSI  (2 unrouted)
N$1
  Top 0.254: 52.07,17.27 51.44,17.27 U2.1 | 54.99,10.16 54.99,9.91 55.75,9.14 53.03,9.14 LED10.2
  Top 2.184: 54.99,10.16 54.99,14.35 52.07,17.27
  pour Top (no thermals): 51.5,18.1 49.97,18.1 49.97,16.32 51.5,16.32
  pour Top (no thermals): 57.09,8.57 57.09,10.22 52.77,10.22 52.77,8.57
N$2
  Top 0.61: CON15.1 R16.1
N$3
  Top 0.305: C7.1 C2.1 C12.1 C9.1
  pour Top (no thermals): 70.8,52.07 71.69,-1.27 86.36,-1.27 99.06,11.43 99.06,39.37 86.36,52.07
N$5  (1 unrouted)
  Top 0.61: C8.2 C6.2 79.33,27.79 C9.2 | C9.2 C12.2 C2.2 C7.2 | C9.2 76.08,27.74 CON15.3
  pour Bottom (no thermals): 70.8,52.07 71.44,-1.27 86.36,-1.27 99.06,11.43 99.06,39.37 86.36,52.07
N$6
  Top 0.61: LED7.2 83.63,11.03 R25.2
N$9  (2 unrouted)
N$10  (1 unrouted)
  Top 0.61: R13.1 84.02,44.25 89.65,38.62 R12.1 92.51,33.02 R14.1 92.51,17.46 R10.1 90.6,13.45 89.53,12.38 | 89.53,12.38 84.97,7.82 R25.1 81.39,7.82 77.67,11.54 R11.1 | 84.5,17.41 89.53,12.38
N$11  (1 unrouted)
  Top 0.61: R16.2 82.5,22.86
N$13
  Top 0.61: LED2.2 89.1,19.07 R10.2
N$14
  Top 0.61: LED3.2 75.25,7.78 R11.2
N$15
  Top 0.61: LED4.2 86.12,37.91 R12.2
N$16
  Top 0.61: LED5.2 81.45,42.6 R13.2
N$17
  Top 0.61: LED6.2 91.01,27.73 R14.2
N$20  (2 unrouted)
N$21  (1 unrouted)
N$22
  Top 0.254: LED10.1 R27.2
N$23
  Top 0.61: 50.48,19.75 50.74,19.49 U2.3
  Top 2.184: U$4.1 48.02,18.87 48.9,19.75 50.48,19.75
  Top 2.54: U$3.1 U$4.1
  pour Top (no thermals): 51.5,20.64 49.97,20.64 49.97,18.86 51.5,18.86
N$24  (1 unrouted)
N$26  (1 unrouted)
N$27  (1 unrouted)
N$28  (1 unrouted)
N$29  (1 unrouted)
N$30  (1 unrouted)
N$31  (1 unrouted)
N$32  (1 unrouted)
N$33  (1 unrouted)
N$34  (1 unrouted)
N$35  (1 unrouted)
N$36  (1 unrouted)
N$37  (1 unrouted)
N$38  (1 unrouted)
N$39  (1 unrouted)
N$40  (1 unrouted)
N$41  (1 unrouted)
N$42  (1 unrouted)
N$43  (1 unrouted)
N$44  (1 unrouted)
N$45  (1 unrouted)
N$46  (1 unrouted)
N$47  (2 unrouted)
N$48  (2 unrouted)
N$49  (1 unrouted)
N$50  (1 unrouted)
N$51  (1 unrouted)
N$52  (1 unrouted)
N$53  (1 unrouted)
N$54  (1 unrouted)
N$55  (1 unrouted)
N$56  (1 unrouted)
N$57  (1 unrouted)
N$60  (1 unrouted)
N$61  (1 unrouted)
RED  (2 unrouted)
RESET  (5 unrouted)
SCK  (2 unrouted)

### Text on the board
tPlace: UART 1 | UART 2 | - | + | s | IR TX | - | I2C | - | + | + | s | LEDs